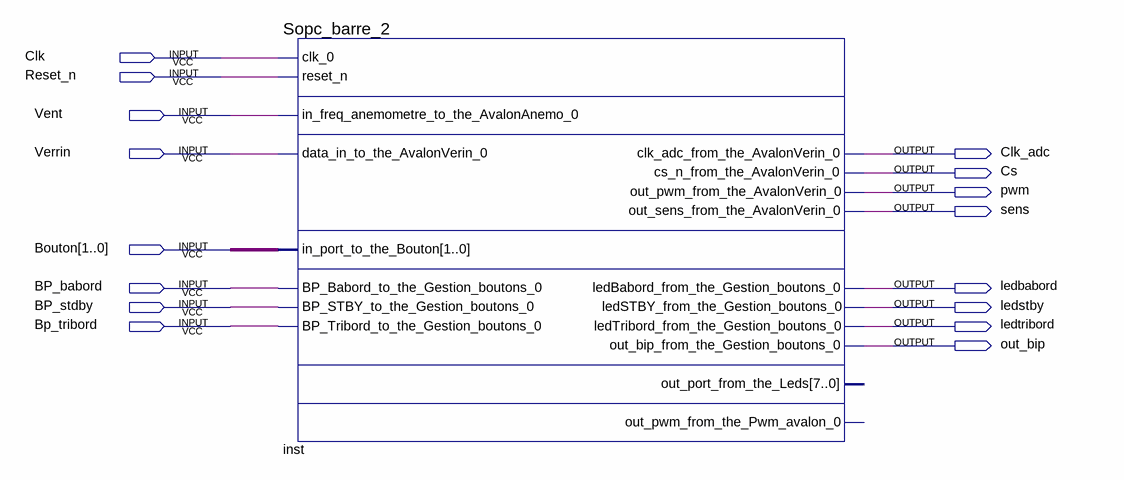
[diagram p0: schematic sheet]
// Quartus schematic Sopc_Barre.bdf as structural Verilog: 1 symbols, 16 pins
module Sopc_Barre (
  input  Clk,
  input  Reset_n,
  input  Vent,
  input  Verrin,
  input  [1:0] Bouton,
  input  BP_babord,
  input  BP_stdby,
  input  Bp_tribord,
  output Clk_adc,
  output Cs,
  output pwm,
  output sens,
  output ledbabord,
  output ledstby,
  output ledtribord,
  output out_bip
);

  Sopc_barre_2 inst (
    .clk_0(Clk), .reset_n(Reset_n), .in_freq_anemometre_to_the_AvalonAnemo_0(Vent),
    .data_in_to_the_AvalonVerin_0(Verrin), .in_port_to_the_Bouton(Bouton),
    .BP_Babord_to_the_Gestion_boutons_0(BP_babord), .BP_STBY_to_the_Gestion_boutons_0(BP_stdby),
    .BP_Tribord_to_the_Gestion_boutons_0(Bp_tribord), .clk_adc_from_the_AvalonVerin_0(Clk_adc),
    .cs_n_from_the_AvalonVerin_0(Cs), .out_pwm_from_the_AvalonVerin_0(pwm),
    .out_sens_from_the_AvalonVerin_0(sens), .ledBabord_from_the_Gestion_boutons_0(ledbabord),
    .ledSTBY_from_the_Gestion_boutons_0(ledstby), .ledTribord_from_the_Gestion_boutons_0(ledtribord),
    .out_bip_from_the_Gestion_boutons_0(out_bip));  // open: out_port_from_the_Leds, out_pwm_from_the_Pwm_avalon_0
endmodule
